# Altium schematic sheet UART_DEBUG.SchDoc
size 209 x 297 mm; SheetNumber: 12; SheetTotal: 23
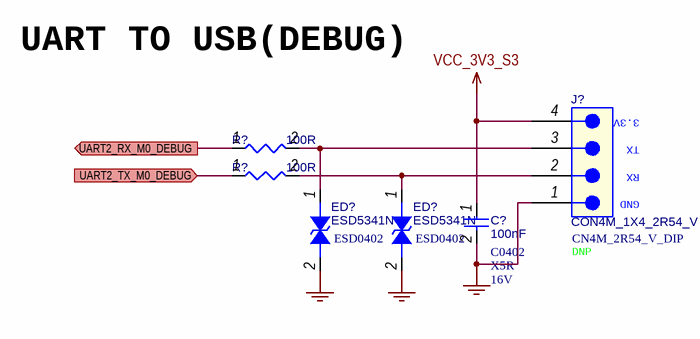
[diagram p0: UART_DEBUG.SchDoc]

## Parts
(Parts that share a designator on the sheet are numbered #1, #2 ... from top to bottom, then left to right.)
C?  100nF  Dielectric: X5R  Voltage: 16V  [C0402]
ED?#1  ESD5341N  [ESD0402]
ED?#2  ESD5341N  [ESD0402]
J?  CON4M_1X4_2R54_V  OPTION: DNP  [CN4M_2R54_V_DIP]
R?#1  100R  [R0402]
R?#2  100R  [R0402]

## Ports
UART2_RX_M0_DEBUG (out, see RK3588_OSC_PLL[3C]), UART2_TX_M0_DEBUG (in, see RK3588_OSC_PLL[3C])

## Nets
GND: C?.2 ED?#1.2 ED?#2.2 J?.1
VCC_3V3_S3: C?.1 J?.4
UART2_RX_M0_DEBUG: R?#1.1 ; port UART2_RX_M0_DEBUG
UART2_TX_M0_DEBUG: R?#2.1 ; port UART2_TX_M0_DEBUG
NetED?#1_1: ED?#1.1 J?.3 R?#1.2
NetED?#2_1: ED?#2.1 J?.2(RX) R?#2.2

## Notes on the sheet
- UART TO USB(DEBUG)
- 297x210
- Формат А4
- (in symbol HEADER 4_2) 3.3V; TX; GND

## Library data of the parts
C? = CAP NP_Dup1: cap,100.00nF,+/-10%,16V,X5R,C0402; Part Reference: C9300; Manufacturer PN: C1005X5R1C104K050BA; Manufacturer: TDK; Tolerance: 10%; Priority: A; PCB Footprint: C0402; Value: 100nF; Created by: JJJ; Part Type: C0402; RK PN: C1005X5R1C104K050BA
ED?#1 = DIODE BI_DIR TRIG: 1-Line, Bi-directional, Transient Voltage Suppressors.1pF.; Part Reference: ED9300; Manufacturer: WillSemi(О¤¶ы°лµјМе); Priority: A; PCB Footprint: ESD0402; Value: ESD5341N; Created by: JJJ; Manufacturer PN: ESD5341N; Part Type: ESD_TVS; RK PN: ESD5341N
ED?#2 = DIODE BI_DIR TRIG: 1-Line, Bi-directional, Transient Voltage Suppressors.1pF.; Part Reference: ED9301; Manufacturer: WillSemi(О¤¶ы°лµјМе); Priority: A; PCB Footprint: ESD0402; Value: ESD5341N; Created by: JJJ; Manufacturer PN: ESD5341N; Part Type: ESD_TVS; RK PN: ESD5341N
J? = HEADER 4_2: Part Reference: J9300; Value: CON4M_1X4_2R54_V; PCB Footprint: CN4M_2R54_V_DIP
R?#1 = RESISTOR_Dup2: НЁУГєсД¤µзЧи,100R,+/-5%,R0402,1/16W.; Part Reference: R9300; Manufacturer: YAGEO; RK PN: RC0402JR-07100RL; Priority: A; Wattage: 1/16W; Value: 100R; Part Type: НЁУГєсД¤µзЧи; Manufacturer PN: RC0402JR-07100RL; Created by: YTL
R?#2 = RESISTOR_Dup2: НЁУГєсД¤µзЧи,100R,+/-5%,R0402,1/16W.; Part Reference: R9301; Manufacturer PN: RC0402JR-07100RL; Manufacturer: YAGEO; Wattage: 1/16W; Priority: A; Value: 100R; Created by: YTL; Part Type: НЁУГєсД¤µзЧи; RK PN: RC0402JR-07100RL